# EAGLE design RMMB (EAGLE 9.5.0)
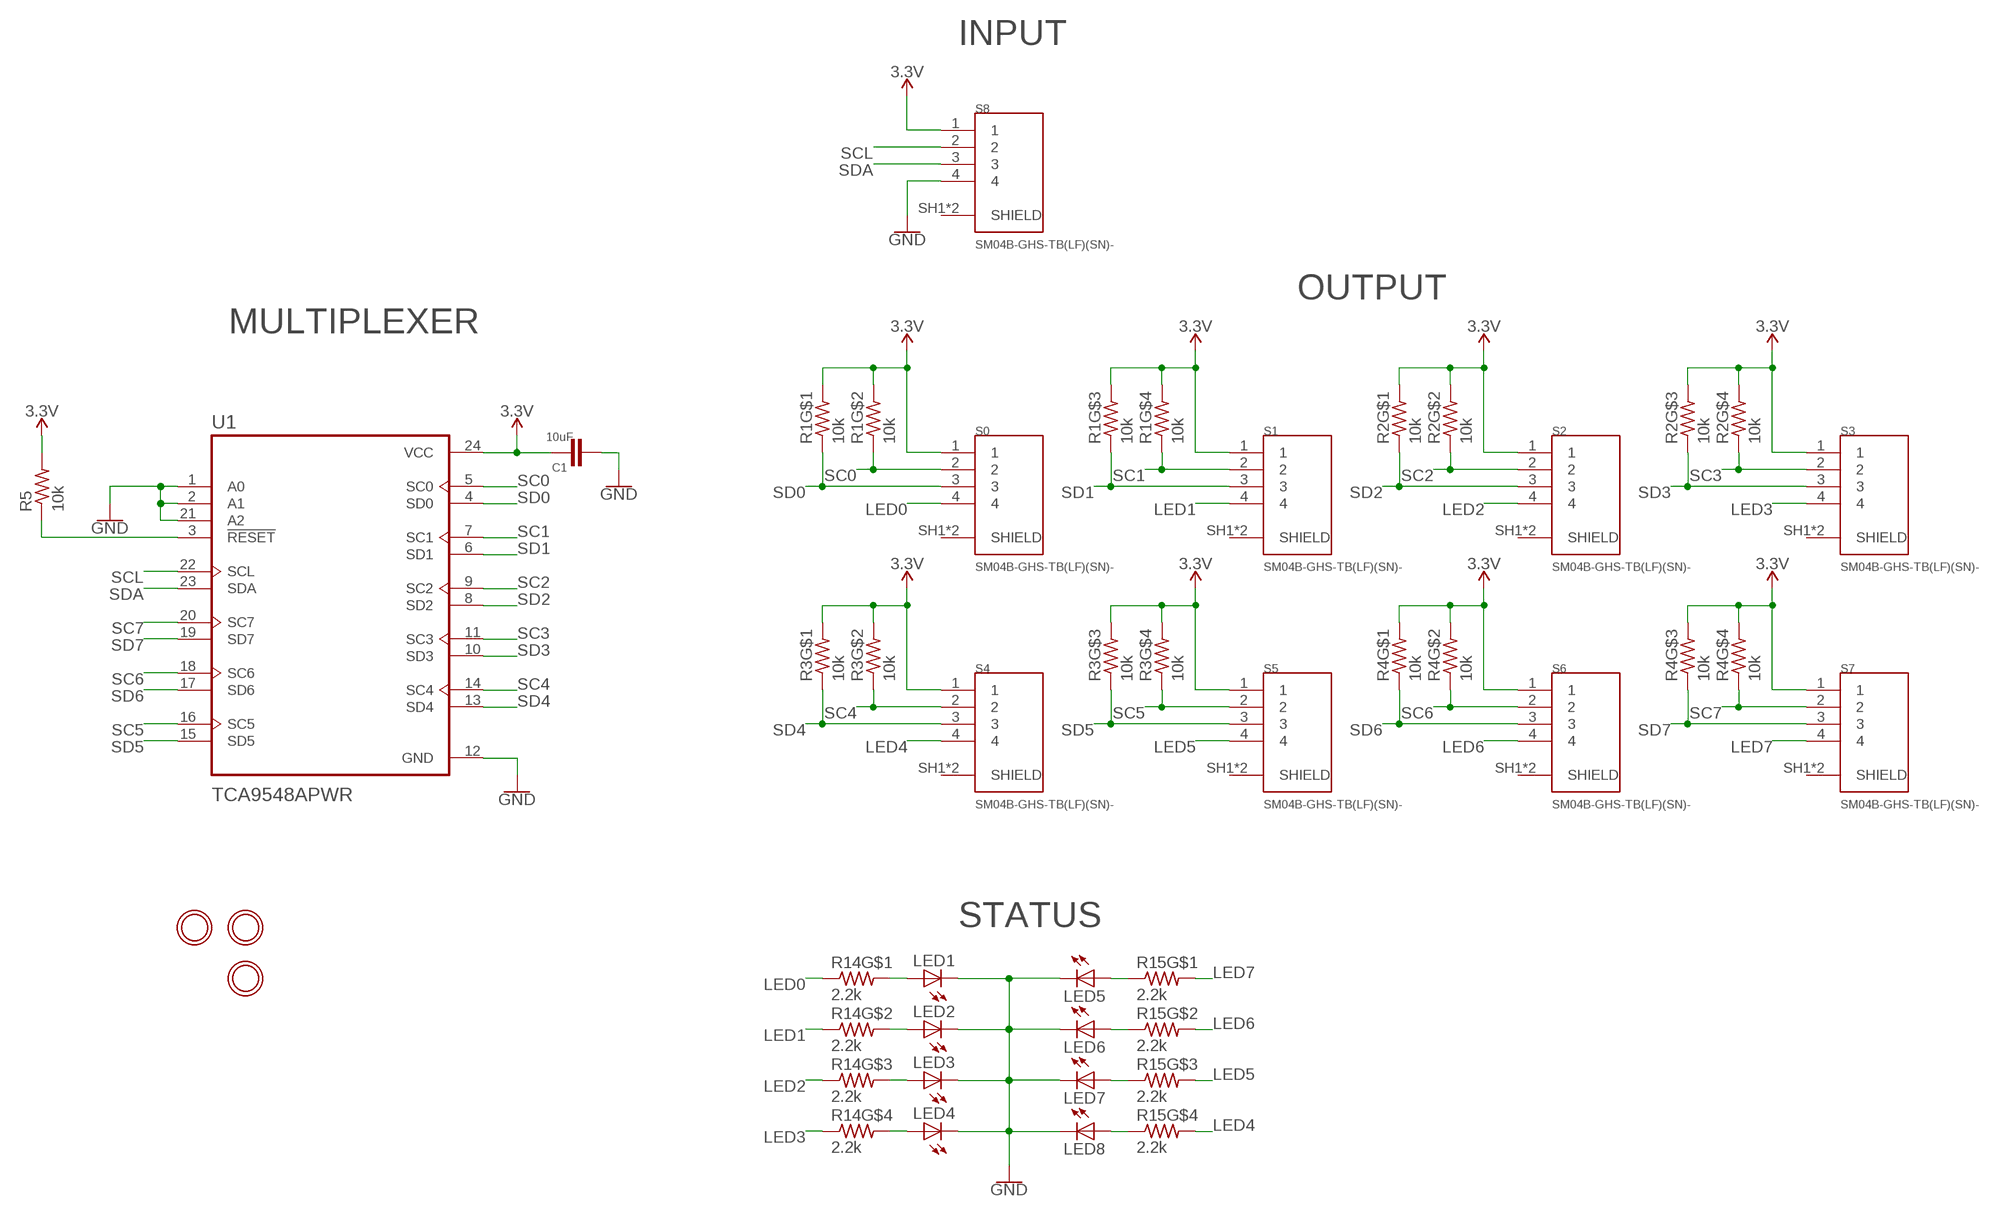
[diagram p0: schematic, sheet 1]

## Parts
C1  10uF  C-EUC0603  [C0603]
LED1  LEDCHIP-LED0603  [CHIP-LED0603]
LED2  LEDCHIP-LED0603  [CHIP-LED0603]
LED3  LEDCHIP-LED0603  [CHIP-LED0603]
LED4  LEDCHIP-LED0603  [CHIP-LED0603]
LED5  LEDCHIP-LED0603  [CHIP-LED0603]
LED6  LEDCHIP-LED0603  [CHIP-LED0603]
LED7  LEDCHIP-LED0603  [CHIP-LED0603]
LED8  LEDCHIP-LED0603  [CHIP-LED0603]
R1  10k  RESISTOR_4PACK_US  [RESPACK_4X0603]
R2  10k  RESISTOR_4PACK_US  [RESPACK_4X0603]
R3  10k  RESISTOR_4PACK_US  [RESPACK_4X0603]
R4  10k  RESISTOR_4PACK_US  [RESPACK_4X0603]
R5  10k  R-US_R0603  [R0603]
R14  2.2k  RESISTOR_4PACK_US  [RESPACK_4X0603]
R15  2.2k  RESISTOR_4PACK_US  [RESPACK_4X0603]
S0  SM04B-GHS-TB(LF)(SN)-  [JST_SM04B-GHS-TB(LF)(SN)-]
S1  SM04B-GHS-TB(LF)(SN)-  [JST_SM04B-GHS-TB(LF)(SN)-]
S2  SM04B-GHS-TB(LF)(SN)-  [JST_SM04B-GHS-TB(LF)(SN)-]
S3  SM04B-GHS-TB(LF)(SN)-  [JST_SM04B-GHS-TB(LF)(SN)-]
S4  SM04B-GHS-TB(LF)(SN)-  [JST_SM04B-GHS-TB(LF)(SN)-]
S5  SM04B-GHS-TB(LF)(SN)-  [JST_SM04B-GHS-TB(LF)(SN)-]
S6  SM04B-GHS-TB(LF)(SN)-  [JST_SM04B-GHS-TB(LF)(SN)-]
S7  SM04B-GHS-TB(LF)(SN)-  [JST_SM04B-GHS-TB(LF)(SN)-]
S8  SM04B-GHS-TB(LF)(SN)-  [JST_SM04B-GHS-TB(LF)(SN)-]
U1  TCA9548APWR  [SOP65P640X120-24N]
U$1  MOUNTINGHOLE2.5  [MOUNTINGHOLE_2.5_PLATED]
U$2  MOUNTINGHOLE2.5  [MOUNTINGHOLE_2.5_PLATED]
U$31  MOUNTINGHOLE2.5  [MOUNTINGHOLE_2.5_PLATED]

## Nets
3.3V: C1.1 R1.5 R1.6 R1.7 R1.8 R2.5 R2.6 R2.7 R2.8 R3.5 R3.6 R3.7 R3.8 R4.5 R4.6 R4.7 R4.8 R5.2 S0.1 S1.1 S2.1 S3.1 S4.1 S5.1 S6.1 S7.1 S8.1 U1.24(VCC)
GND: C1.2 LED1.C LED2.C LED3.C LED4.C LED5.C LED6.C LED7.C LED8.C S8.4 U1.1(A0) U1.2(A1) U1.12(GND) U1.21(A2)
LED0: R14.1 S0.4
LED1: R14.2 S1.4
LED2: R14.3 S2.4
LED3: R14.4 S3.4
LED4: R15.5 S4.4
LED5: R15.6 S5.4
LED6: R15.7 S6.4
LED7: R15.8 S7.4
N$1: LED1.A R14.8
N$2: R5.1 U1.3(!RESET)
N$4: LED2.A R14.7
N$6: LED3.A R14.6
N$8: LED4.A R14.5
N$10: LED5.A R15.1
N$12: LED6.A R15.2
N$14: LED7.A R15.3
N$16: LED8.A R15.4
SC0: R1.2 S0.2 U1.5(SC0)
SC1: R1.4 S1.2 U1.7(SC1)
SC2: R2.2 S2.2 U1.9(SC2)
SC3: R2.4 S3.2 U1.11(SC3)
SC4: R3.2 S4.2 U1.14(SC4)
SC5: R3.4 S5.2 U1.16(SC5)
SC6: R4.2 S6.2 U1.18(SC6)
SC7: R4.4 S7.2 U1.20(SC7)
SCL: S8.2 U1.22(SCL)
SD0: R1.1 S0.3 U1.4(SD0)
SD1: R1.3 S1.3 U1.6(SD1)
SD2: R2.1 S2.3 U1.8(SD2)
SD3: R2.3 S3.3 U1.10(SD3)
SD4: R3.1 S4.3 U1.13(SD4)
SD5: R3.3 S5.3 U1.15(SD5)
SD6: R4.1 S6.3 U1.17(SD6)
SD7: R4.3 S7.3 U1.19(SD7)
SDA: S8.3 U1.23(SDA)

## Notes on the sheet
- INPUT
- OUTPUT
- MULTIPLEXER
- STATUS

## Power pins joined to a net without a drawn wire
SHIELD: S0.SH1(SHIELD) S0.SH2(SHIELD) S1.SH1(SHIELD) S1.SH2(SHIELD) S2.SH1(SHIELD) S2.SH2(SHIELD) S3.SH1(SHIELD) S3.SH2(SHIELD) S4.SH1(SHIELD) S4.SH2(SHIELD) S5.SH1(SHIELD) S5.SH2(SHIELD) S6.SH1(SHIELD) S6.SH2(SHIELD) S7.SH1(SHIELD) S7.SH2(SHIELD) S8.SH1(SHIELD) S8.SH2(SHIELD)

## Library data of the parts
C1 = rcl:C-EU: CAPACITOR, European symbol; SPICEPREFIX: C
LED1-LED8 = adafruit:LED: LED OSRAM: - CHIPLED LG R971, LG N971, LY N971, LG Q971, LY Q971, LO R971, LY R971 LH N974, LH R974 LS Q976, LO Q976, LY Q976 LO Q996 - Hyper CHIPLED LW Q18S LB Q993, LB Q99A, LB R99A - SideLED LS A670, LO A670, LY A670, LG A670, LP A670 LB A673, LV A673, LT A673, LW A673 LH A674 LY A675 LS A676, LA A676, LO A676, LY A676, LW A676 LS A679, LY A679, LG A679 - Hyper Micro SIDELED® LS Y876, LA Y876, LO Y876, LY Y876 LT Y87S - SmartLED LW L88C, LW L88S LB L89C, LB L89S, LG L890 LS L89K, LO L89K, LY L89K LS L896, LA L896, LO L896, LY L896 - TOPLED LS T670, LO T670, LY T670, LG T670, LP T670 LSG T670, LSP T670, LSY T670, LOP T670, LYG T670 LG T671, LOG T671, LSG T671 LB T673, LV T673, LT T673, LW T673 LH T674 LS T676, LA T676, LO T676, LY T676, LB T676, LH T676, LSB T676, LW T676 LB T67C, LV T67C, LT T67C, LS T67K, LO T67K, LY T67K, LW E67C LS E67B, LA E67B, LO E67B, LY E67B, LB E67C, LV E67C, LT E67C LW T67C LS T679, LY T679, LG T679 LS T770, LO T770, LY T770, LG T770, LP T770 LB T773, LV T773, LT T773, LW T773 LH T774 LS E675, LA E675, LY E675, LS T675 LS T776, LA T776, LO T776, LY T776, LB T776 LHGB T686 LT T68C, LB T68C - Hyper Mini TOPLED® LB M676 - Mini TOPLED Santana® LG M470 LS M47K, LO M47K, LY M47K Source: http://www.osram.convergy.de/
R1-R4 R14 R15 = microbuilder:RESISTOR_4PACK_US: Resistor Packs (4 resistors) 4 x 0603 10K 1/16W - Digikey: YC164J-10KCT-ND
R5 = rcl:R-US_: RESISTOR, American symbol; SPICEPREFIX: R
S0 S1-S8 = SM04B-GHS-TB_LF__SN_-:SM04B-GHS-TB(LF)(SN)-: Conn Header Gh Side 4pos 1.25mm; AVAILABILITY: Unavailable; DESCRIPTION: Connector Header Surface Mount, Right Angle 4 position 0.049 _1.25mm_; MF: JST Sales; MP: SM04B-GHS-TB_LF__SN_-; PACKAGE: None; PRICE: None
U1 = _HenrySilva:TCA9548APWR: Low-Voltage 8-Channel I2C Switch With Reset 24-TSSOP -40 to 85; DESCRIPTION: IC I2C SW 8CH W/RESET 24TSSOP; DIGI-KEY_PART_NUMBER: 296-34905-1-ND; DIGI-KEY_PURCHASE_URL: https://www.digikey.com/product-detail/en/texas-instruments/TCA9548APWR/296-34905-1-ND/3615448?utm_source=snapeda&utm_medium=aggregator&utm_campaign=symbol; MF: Texas Instruments; MP: TCA9548APWR; PACKAGE: TSSOP-24 Texas Instruments
U$1 U$2 U$31 = microbuilder:MOUNTINGHOLE: Mounting Hole For #2 screws (0.086"/2.18mm width, 0.094"/2.4mm hole) use 2.5mm; BOM: EXCLUDE

## Net classes
2 gnd: width 0.254 mm

## Board
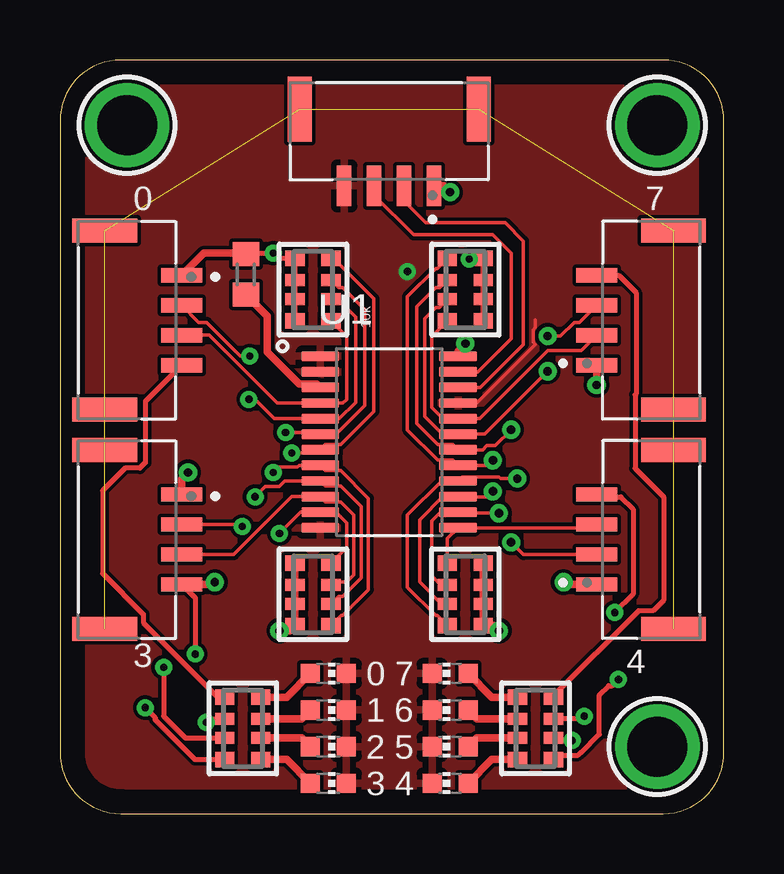
[diagram p1: board, top side]
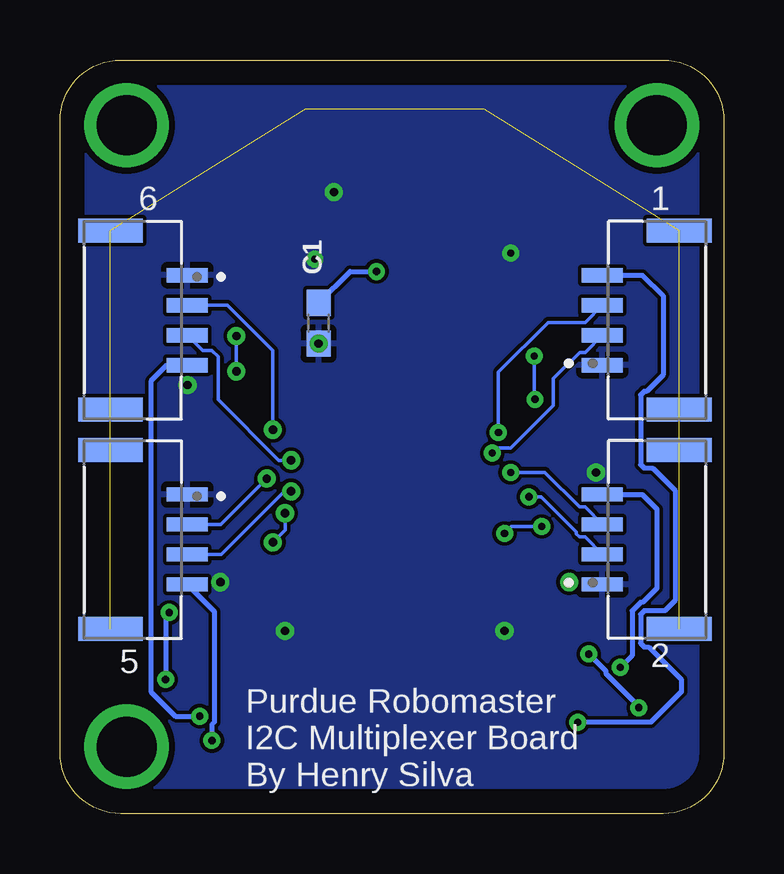
[diagram p2: board, bottom side, seen from below]

Size 27.67 x 31.42 mm. Coordinates in mm from the lower left corner, seen from the top.
Outline: 0,28.88 0,2.54 arc90 2.54,0 25.13,0 arc90 27.67,2.54 27.67,28.88 arc90 25.13,31.42 2.54,31.42 arc90 0,28.88
Copper layers (1*16): Top 0.035mm / dielectric 1.5mm / Bottom 0.035mm
Design rules "default *": minimum track width 6mil, minimum drill 0.3mm, track to track 6mil, track to pad 6mil, pad to pad 6mil, via to via 6mil, smd to smd 6mil, copper to edge 40mil, drill to drill 6mil, minimum pad ring 10mil, minimum via ring 8mil, stop-mask expansion 4mil, vias tented up to drill 0mil, thermal gap 10mil

### Footprints (pad centres in the part's own frame; a part is rotated, then mirrored left to right if it is on the bottom)
C0603 = smd 1.1 x 1: 1 -0.85,0; 2 0.85,0
CHIP-LED0603 = smd 0.8 x 0.8: A 0,-0.75; C 0,0.75
RESPACK_4X0603 = smd 0.65 x 0.8: 1 -1.3,-0.75; 4 1.3,-0.75; 5 1.3,0.75; 8 -1.3,0.75 | smd 0.5 x 0.8: 2 -0.4,-0.75; 3 0.4,-0.75; 6 0.4,0.75; 7 -0.4,0.75
R0603 = smd 1 x 1.1: 1 -0.85,0; 2 0.85,0
JST_SM04B-GHS-TB(LF)(SN)- = smd 0.6 x 1.7: 1 -1.875,2.275; 2 -0.625,2.275; 3 0.625,2.275; 4 1.875,2.275 | smd 1 x 2.7: SH1 -3.725,-0.925; SH2 3.725,-0.925
SOP65P640X120-24N = smd 1.57 x 0.41: 1 -2.87,3.575; 2 -2.87,2.925; 3 -2.87,2.275; 4 -2.87,1.625; 5 -2.87,0.975; 6 -2.87,0.325; 7 -2.87,-0.325; 8 -2.87,-0.975; 9 -2.87,-1.625; 10 -2.87,-2.275; 11 -2.87,-2.925; 12 -2.87,-3.575; 13 2.87,-3.575; 14 2.87,-2.925; 15 2.87,-2.275; 16 2.87,-1.625; 17 2.87,-0.975; 18 2.87,-0.325; 19 2.87,0.325; 20 2.87,0.975; 21 2.87,1.625; 22 2.87,2.275; 23 2.87,2.925; 24 2.87,3.575
MOUNTINGHOLE_2.5_PLATED = drill 2.5 pad 3.2: P$1 0,0

### Placement (x,y rotation side)
C1  16.89,20.45 90 bottom
LED1  11.18,5.84 270 top
LED2  11.18,4.32 270 top
LED3  11.18,2.79 270 top
LED4  11.18,1.27 270 top
LED5  16.26,5.84 90 top
LED6  16.26,4.32 90 top
LED7  16.26,2.79 90 top
LED8  16.26,1.27 90 top
R1  10.54,21.84 90 top
R2  10.54,9.14 90 top
R3  16.89,9.14 270 top
R4  16.89,21.84 270 top
R5  7.75,22.48 90 top
R14  7.62,3.56 270 top
R15  19.81,3.56 270 top
S0  2.79,20.57 270 top
S1  2.79,20.57 90 bottom
S2  2.79,11.43 90 bottom
S3  2.79,11.43 270 top
S4  24.64,11.43 90 top
S5  24.64,11.43 270 bottom
S6  24.64,20.57 270 bottom
S7  24.64,20.57 90 top
S8  13.72,28.45 180 top
U1  13.72,15.49 0 top
U$1  24.89,28.7 0 top
U$2  24.89,2.79 0 top
U$31  2.79,28.7 0 top

### Tracks (layer width: path | path; a pad name or v marks a point on that pad's centre or on a via)
3.3V  (via drill 0.3, 0.35)
  Top 0.203: R1.8 R1.7 R1.6 R1.5 9.11,23.14 v8.89,23.37 7.87,23.37 7.79,23.37 R5.2 | R4.5 R4.6 R4.7 R4.8 17.61,23.11 v17.05,23.11
  Top 0.305: U1.24 16.59,19.29 C1.1 | S8.1 15.99,26.17 v16.26,25.91 | S0.1 5.99,23.37 7.87,23.37 | R2.5 R2.6 R2.7 R2.8 9.57,7.62 v9.14,7.62 | R3.8 R3.7 R3.6 R3.5 18.06,7.84 v18.29,7.62 | S4.1 21.08,9.55 v20.98,9.65 | S7.1 22.36,17.88 v22.35,17.87 | S3.1 5.07,13.96 v5.33,14.22
  other vias: 16.89,19.6
  pour Bottom: -1.52,-2.29 -1.52,32 -1.52,33.53 29.72,33.53 29.72,-2.29
GND  (via drill 0.3)
  Top 0.152: U1.21 17.37,17.12 19.81,19.56 19.71,19.66 19.71,20.16 19.81,20.26 19.81,20.57
  Bottom 0.203: C1.2 15.58,22.61 v14.48,22.61
  pour Top: -0.76,-1.52 -0.76,32 28.19,32 28.19,-2.29 -0.76,-2.29
LED0
  Top 0.203: S0.4 3.56,17.19 3.56,14.63 3.32,14.4 2.72,14.4 1.78,13.46 1.78,10.01 3.47,8.31 3.47,8.13 3.47,7.96 6.57,4.86 R14.1
LED1  (via drill 0.3)
  Top 0.203: v6.1,3.81 6.24,3.96 R14.2
  Bottom 0.203: S1.4 3.4,22.45 2.54,21.59 2.54,18.29 3.23,17.6 3.32,17.6 3.47,17.45 3.47,14.55 3.32,14.4 2.97,14.4 2.03,13.46 2.03,8.89 2.46,8.46 3.32,8.46 3.47,8.31 3.47,7.1 3.32,6.95 3.14,6.95 1.78,5.59 1.78,5.08 3.05,3.81 v6.1,3.81
LED2  (via drill 0.3)
  Top 0.203: v4.32,6.1 4.32,4.06 5.23,3.16 R14.3
  Bottom 0.203: S2.4 3.4,13.3 2.79,12.7 2.79,9.4 3.38,8.81 3.47,8.81 3.83,8.46 3.83,6.58 v4.32,6.1
LED3  (via drill 0.3, 0.35)
  Top 0.203: S3.4 5.64,8.99 v5.64,6.65 | v3.56,4.42 3.96,4.01 3.96,3.92 5.62,2.26 R14.4
  Top 0.305: S3.4 6.35,9.55 v6.45,9.65
  Bottom 0.203: v5.64,6.65 4.92,5.94 4.92,5.84 3.56,4.47 v3.56,4.42
LED4  (via drill 0.3)
  Top 0.203: S4.4 22.46,13.21 23.37,13.21 23.88,12.7 23.88,9.14 v23.11,8.38 | v23.27,5.59 23.02,5.33 22.86,5.33 22.48,4.95 22.48,3.3 21.72,2.54 21.69,2.54 21.59,2.44 20.75,2.44 R15.5
  Bottom 0.203: v23.11,8.38 23.27,8.23 v23.27,5.59
LED5  (via drill 0.3)
  Top 0.203: v21.34,3.05 20.67,3.05 R15.6
  Bottom 0.203: v21.34,3.05 21.34,3.71 21.24,3.81 21.24,8.43 S5.4
LED6  (via drill 0.3)
  Top 0.203: v21.84,4.06 21.74,3.96 R15.7
  Bottom 0.203: S6.4 23.21,18.7 23.88,18.03 23.88,5.08 22.86,4.06 v21.84,4.06
LED7
  Top 0.203: S7.4 23.27,22.45 24,21.72 24,17.5 23.96,17.45 23.96,14.39 25.15,13.21 25.15,8.89 24.71,8.46 24.11,8.46 20.56,4.91 R15.8
N$1
  Top 0.305: LED1.A 9.44,4.86 R14.8
N$2
  Top 0.305: R5.1 8.64,20.74 8.64,19.24 9.96,17.91 10.71,17.91 U1.3
N$4
  Top 0.305: LED2.A 10.06,3.96 R14.7
N$6
  Top 0.305: LED3.A 10.06,3.16 R14.6
N$8
  Top 0.305: LED4.A 9.44,2.26 R14.5
N$10
  Top 0.305: LED5.A 17.99,4.86 R15.1
N$12
  Top 0.305: LED6.A 17.37,3.96 R15.2
N$14
  Top 0.305: LED7.A 17.37,3.16 R15.3
N$16
  Top 0.305: LED8.A 17.99,2.26 R15.4
SC0  (via drill 0.3)
  Top 0.152: R1.2 11.58,21.44 12.32,20.7 12.32,17.14 11.64,16.47 U1.5 8.93,16.47 8.13,17.27 v7.87,17.27 | S0.2 5.79,20.48 6.12,20.48 7.51,19.08 v7.9,19.08
  Bottom 0.152: v7.9,19.08 7.9,17.3 v7.87,17.27
SC1  (via drill 0.3)
  Top 0.152: R1.4 11.4,23.14 13.08,21.46 13.08,16.77 11.7,15.38 11.06,15.38 U1.7 10.71,15.03 v9.65,15.03
  Bottom 0.152: S1.2 5.79,19.23 6.01,19.23 7.11,18.13 7.11,17.02 8.89,15.24 9.44,15.24 v9.65,15.03
SC2  (via drill 0.3)
  Top 0.152: R2.2 11.61,9.06 11.79,9.06 12.55,9.83 12.55,12.8 11.7,13.65 11.06,13.65 U1.9 9.36,13.87 9.13,13.64 8.56,13.64 v8.13,13.21
  Bottom 0.152: S2.2 5.79,11.53 6.01,11.53 6.15,11.66 6.15,11.74 7.62,13.21 v8.13,13.21
SC3  (via drill 0.3)
  Top 0.152: R2.4 11.94,11.09 11.94,12.11 11.48,12.57 U1.11 10.03,12.57 v9.14,11.68 | S3.2 7.5,12.05 v7.59,11.97
  Bottom 0.152: v7.59,11.97 8.86,11.97 v9.14,11.68
SC4  (via drill 0.35)
  Top 0.152: R3.2 15.86,9.54 15.49,9.91 15.49,12.19 15.87,12.57 U1.14 16.63,12.53 v18.29,12.53 | S4.2 19.3,10.8 v18.8,11.31
  Bottom 0.152: v18.8,11.31 18.29,11.82 v18.29,12.53
SC5  (via drill 0.35)
  Top 0.152: R3.4 15.72,8.27 15.65,8.27 14.48,9.43 14.48,12.45 15.9,13.87 U1.16 16.76,14.04 18.29,14.04 18.36,13.97 v19.05,13.97
  Bottom 0.152: S5.2 20.96,12.05 v19.05,13.97
SC6  (via drill 0.35)
  Top 0.152: R4.2 15.82,21.92 15.65,21.92 14.86,21.14 14.86,16.26 15.74,15.38 16.37,15.38 U1.18 17.61,15.17 17.78,15.34 18.13,15.34 v18.8,16
  Bottom 0.152: S6.2 20.69,21.2 18.8,19.3 v18.8,16
SC7
  Top 0.152: R4.4 15.49,19.9 15.49,16.93 15.95,16.47 U1.20 17.48,16.47 20.32,19.3 21.72,19.3 S7.2
SCL
  Top 0.152: S8.2 14.34,25.54 15.24,24.64 18.54,24.64 19.3,23.88 19.3,19.56 17.52,17.77 U1.22
SD0
  Top 0.152: R1.1 11.94,19.9 11.94,17.27 11.79,17.12 U1.4 9.04,17.12 6.21,19.95 S0.3
SD1  (via drill 0.3)
  Top 0.152: R1.3 11.61,21.92 11.79,21.92 12.7,21.01 12.7,17.02 11.5,15.82 U1.6 10.78,15.89 v9.4,15.89
  Bottom 0.152: S1.3 5.79,20.48 7.33,20.48 9.4,18.41 v9.4,15.89
SD2  (via drill 0.3)
  Top 0.152: R2.1 11.71,8.27 11.79,8.27 12.85,9.33 12.85,13.15 11.7,14.3 11.06,14.3 U1.8 9.96,14.52 9.89,14.45 9.11,14.45 v8.89,14.22
  Bottom 0.152: S2.3 5.79,12.78 6.01,12.78 7.46,14.22 v8.89,14.22
SD3
  Top 0.152: R2.3 11.4,9.65 11.94,9.65 12.24,9.96 12.24,12.46 11.7,13 11.06,13 U1.10 9.66,13.22 7.25,10.8 S3.3
SD4
  Top 0.152: R3.1 16.14,11.47 U1.13 22.23,11.92 S4.3
SD5  (via drill 0.35)
  Top 0.152: R3.3 15.89,8.74 14.99,9.65 14.99,12.25 15.95,13.22 U1.15 17.01,13.22 17.02,13.21 17.81,13.21 v18.03,13.44
  Bottom 0.152: S5.3 20.95,10.8 18.32,13.44 v18.03,13.44
SD6  (via drill 0.35)
  Top 0.152: R4.1 15.72,22.72 15.65,22.72 14.48,21.55 14.48,15.99 15.74,14.73 16.37,14.73 U1.17 17.82,14.52 v18.03,14.73
  Bottom 0.152: S6.3 21.72,19.3 21.34,19.3 21.08,19.05 21.08,17.27 18.54,14.73 v18.03,14.73
SD7  (via drill 0.35)
  Top 0.152: R4.3 15.79,21.1 15.65,21.1 15.19,20.64 15.19,16.56 15.93,15.82 U1.19 17.7,15.82 v20.32,18.44 | S7.3 21.64,20.48 21.42,20.48 20.85,19.91 v20.32,19.91
  Bottom 0.152: v20.32,19.91 v20.32,18.44
SDA
  Top 0.152: S8.3 13.09,25.77 14.73,24.13 18.03,24.13 18.8,23.37 18.8,19.81 17.4,18.42 U1.23
SHIELD  (17 unrouted)

### Text on the board
tPlace: 0 | 7 | 4 | 3 | 0 7 / 1 6 / 2 5 / 3 4
bPlace: 1 | 6 | 5 | 2
bNames: Purdue Robomaster / I2C Multiplexer Board / By Henry Silva